# EAGLE design Teensy_board (EAGLE 7.1.0)
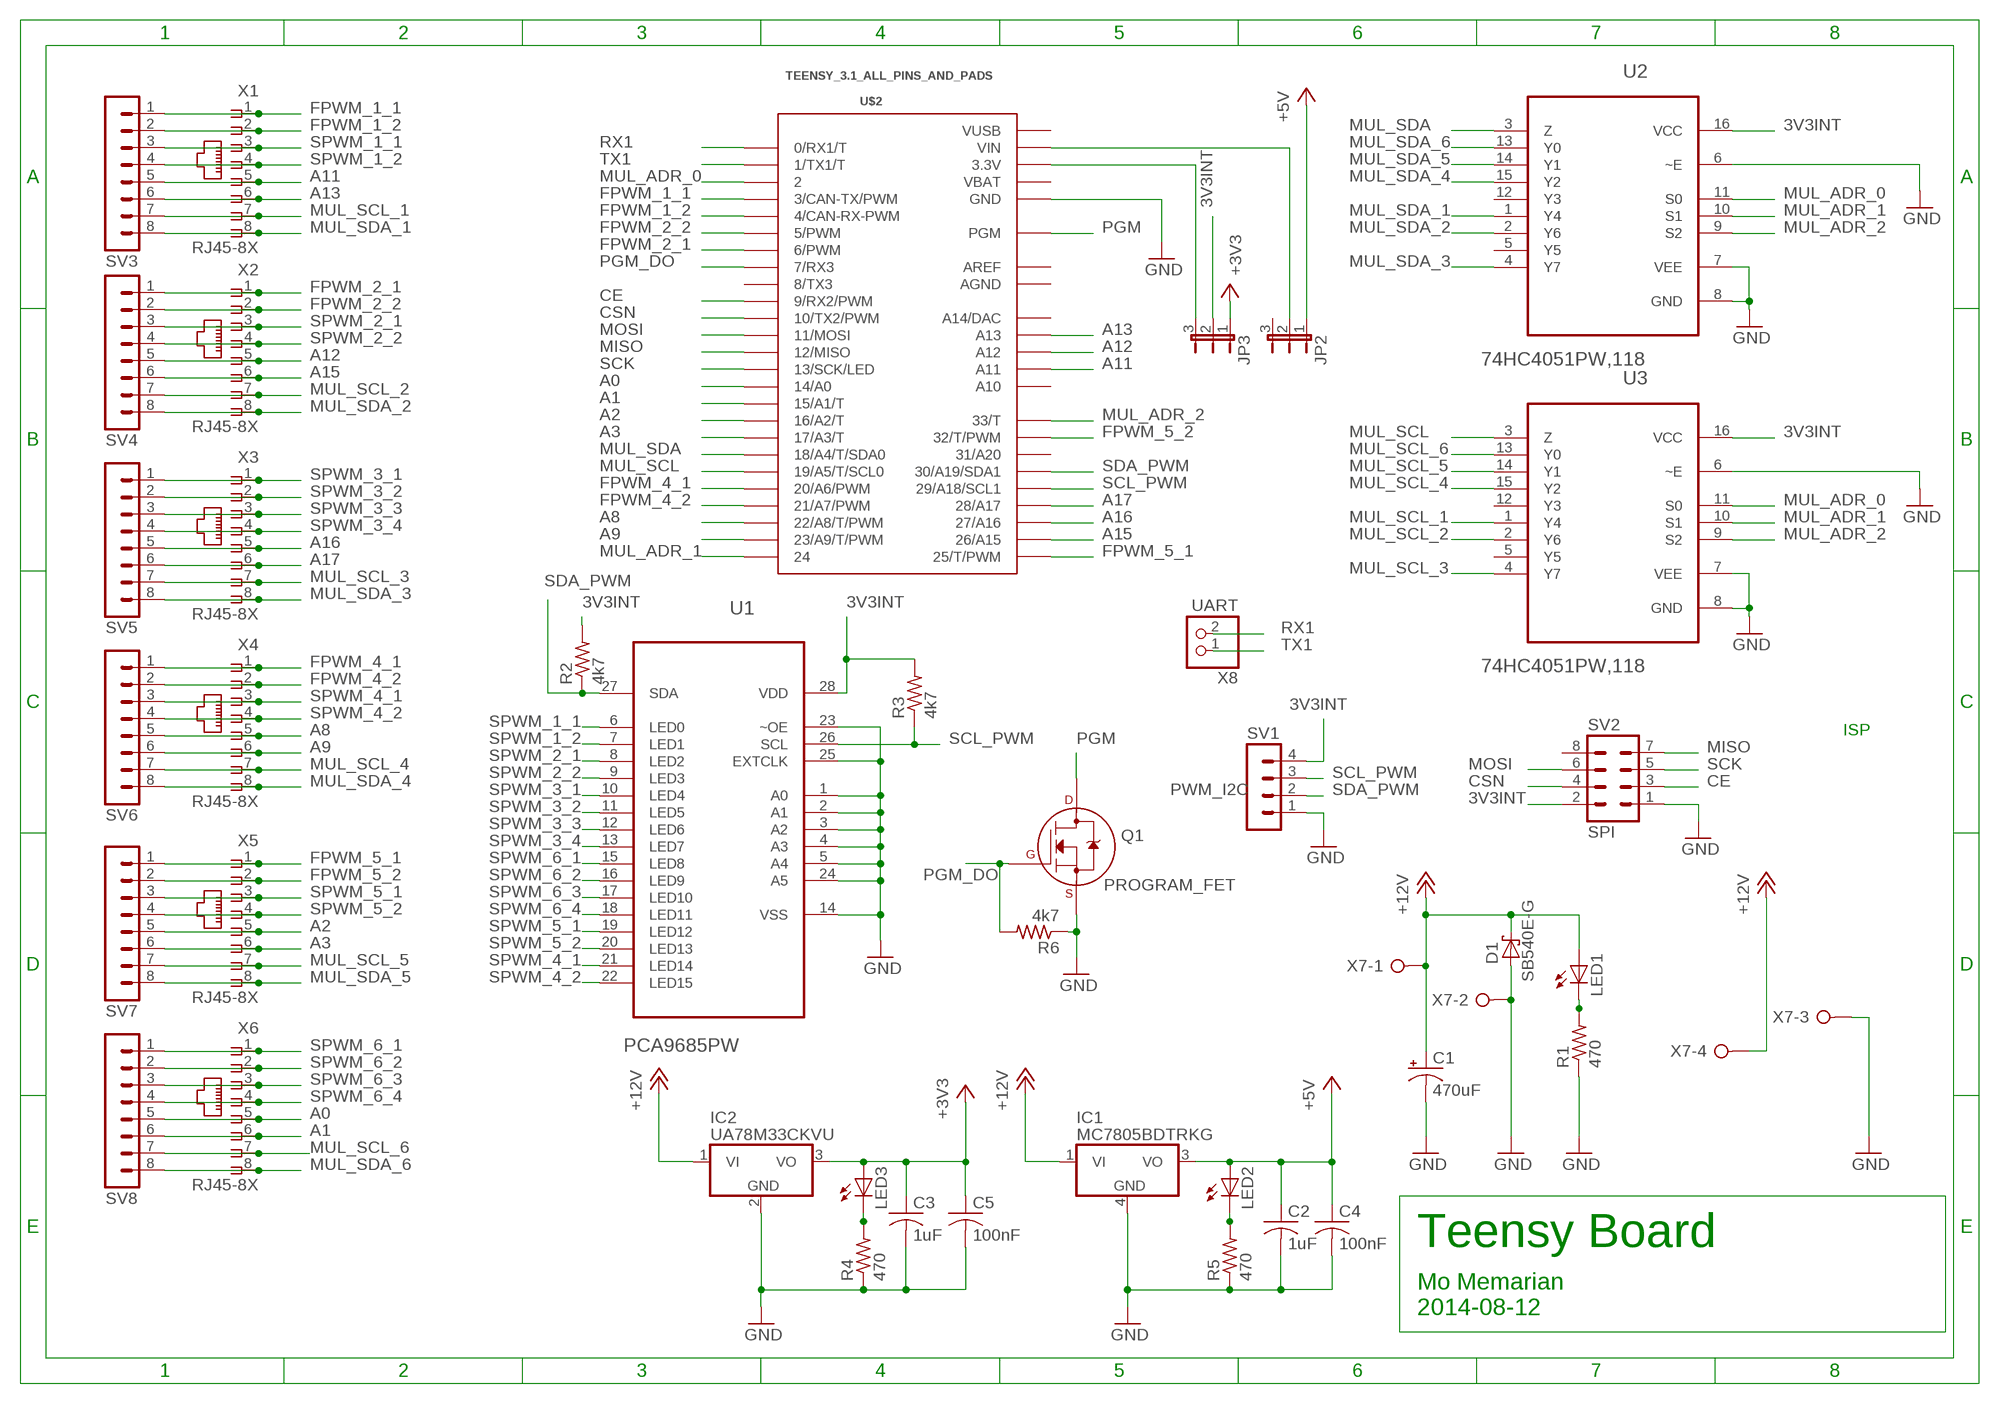
[diagram p0: schematic, sheet 1]

## Parts
C1  470uF  CPOL-USE5-10.5  [E5-10,5]
C2  1uF  C-USC0603  [C0603]
C3  1uF  C-USC0603  [C0603]
C4  100nF  C-USC0603  [C0603]
C5  100nF  C-USC0603  [C0603]
D1  SB540E-G  [DO201T15]
IC1  MC7805BDTRKG  [DPACK_3]
IC2  UA78M33CKVU  [DPACK]
JP2  JP2E  [JP2]
JP3  JP2E  [JP2]
LED1  LEDSML1206  [SML1206]
LED2  LEDSML1206  [SML1206]
LED3  LEDSML1206  [SML1206]
Q1  PROGRAM_FET  2N7002_SOT23  [SOT-23]
R1  470  R-US_R0603  [R0603]
R2  4k7  R-US_R0603  [R0603]
R3  4k7  R-US_R0603  [R0603]
R4  470  R-US_R0603  [R0603]
R5  470  R-US_R0603  [R0603]
R6  4k7  R-US_R0603  [R0603]
SV1  PWM_I2C  MA04-1  [MA04-1]
SV2  SPI  MA04-2  [MA04-2]
SV3  MA08-1  [MA08-1]
SV4  MA08-1  [MA08-1]
SV5  MA08-1  [MA08-1]
SV6  MA08-1  [MA08-1]
SV7  MA08-1  [MA08-1]
SV8  MA08-1  [MA08-1]
U1  PCA9685PW  [SOP65P640X110-28N]
U2  74HC4051PW,118  [SOP65P640X110-16N]
U3  74HC4051PW,118  [SOP65P640X110-16N]
U$2  TEENSY_3.1_ALL_PINS_AND_PADS  [TEENSY_3.1_ALLPINS]
X1  RJ45-8X  [RJ45-NO-SHIELD]
X2  RJ45-8X  [RJ45-NO-SHIELD]
X3  RJ45-8X  [RJ45-NO-SHIELD]
X4  RJ45-8X  [RJ45-NO-SHIELD]
X5  RJ45-8X  [RJ45-NO-SHIELD]
X6  RJ45-8X  [RJ45-NO-SHIELD]
X7  W237-04P  [W237-4P]
X8  UART  PINHD-1X2  [1X02]

## Nets
3V3INT: JP3.2 R2.2 R3.2 SV1.4 SV2.2 U1.28(VDD) U2.16(VCC) U3.16(VCC)
+3V3: C3.1 C5.1 IC2.3(VO) JP3.1 LED3.A
+5V: C2.1 C4.1 IC1.3(VO) JP2.1 LED2.A
+12V: C1.+ D1.C IC1.1(VI) IC2.1(VI) LED1.A X7.1 X7.4
A0: SV8.5 U$2.14/A0 X6.5
A1: SV8.6 U$2.15/A1(15/A1/T) X6.6
A2: SV7.5 U$2.16/A2(16/A2/T) X5.5
A3: SV7.6 U$2.17/A3(17/A3/T) X5.6
A8: SV6.5 U$2.22/A8(22/A8/T/PWM) X4.5
A9: SV6.6 U$2.23/A9(23/A9/T/PWM) X4.6
A11: SV3.5 U$2.A11 X1.5
A12: SV4.5 U$2.A12 X2.5
A13: SV3.6 U$2.A13 X1.6
A15: SV4.6 U$2.26(26/A15) X2.6
A16: SV5.5 U$2.27(27/A16) X3.5
A17: SV5.6 U$2.28(28/A17) X3.6
CE: SV2.3 U$2.9(9/RX2/PWM)
CSN: SV2.4 U$2.10(10/TX2/PWM)
FPWM_1_1: SV3.1 U$2.3(3/CAN-TX/PWM) X1.1
FPWM_1_2: SV3.2 U$2.4(4/CAN-RX-PWM) X1.2
FPWM_2_1: SV4.1 U$2.6(6/PWM) X2.1
FPWM_2_2: SV4.2 U$2.5(5/PWM) X2.2
FPWM_4_1: SV6.1 U$2.20/A6(20/A6/PWM) X4.1
FPWM_4_2: SV6.2 U$2.21/A7(21/A7/PWM) X4.2
FPWM_5_1: SV7.1 U$2.25(25/T/PWM) X5.1
FPWM_5_2: SV7.2 U$2.32(32/T/PWM) X5.2
GND: C1.- C2.2 C3.2 C4.2 C5.2 D1.A IC1.4(GND) IC2.2(GND) Q1.2(S) R1.1 R4.1 R5.1 R6.1 SV1.1 SV2.1 U1.1(A0) U1.2(A1) U1.3(A2) U1.4(A3) U1.5(A4) U1.14(VSS) U1.23(~OE) U1.24(A5) U1.25(EXTCLK) U2.6(~E) U2.7(VEE) U2.8(GND) U3.6(~E) U3.7(VEE) U3.8(GND) U$2.GND U$2.GND1(GND) U$2.GND2(GND) X7.2 X7.3
MISO: SV2.7 U$2.12(12/MISO)
MOSI: SV2.6 U$2.11(11/MOSI)
MUL_ADR_0: U2.11(S0) U3.11(S0) U$2.2
MUL_ADR_1: U2.10(S1) U3.10(S1) U$2.24
MUL_ADR_2: U2.9(S2) U3.9(S2) U$2.33(33/T)
MUL_SCL: U3.3(Z) U$2.19/A5(19/A5/T/SCL0)
MUL_SCL_1: SV3.7 U3.1(Y4) X1.7
MUL_SCL_2: SV4.7 U3.2(Y6) X2.7
MUL_SCL_3: SV5.7 U3.4(Y7) X3.7
MUL_SCL_4: SV6.7 U3.15(Y2) X4.7
MUL_SCL_5: SV7.7 U3.14(Y1) X5.7
MUL_SCL_6: SV8.7 U3.13(Y0) X6.7
MUL_SDA: U2.3(Z) U$2.18/A4(18/A4/T/SDA0)
MUL_SDA_1: SV3.8 U2.1(Y4) X1.8
MUL_SDA_2: SV4.8 U2.2(Y6) X2.8
MUL_SDA_3: SV5.8 U2.4(Y7) X3.8
MUL_SDA_4: SV6.8 U2.15(Y2) X4.8
MUL_SDA_5: SV7.8 U2.14(Y1) X5.8
MUL_SDA_6: SV8.8 U2.13(Y0) X6.8
N$10: LED1.C R1.2
N$18: LED3.C R4.2
N$19: LED2.C R5.2
PGM: Q1.3(D) U$2.PGM
PGM_DO: Q1.1(G) R6.2 U$2.7(7/RX3)
RX1: U$2.0(0/RX1/T) X8.2
SCK: SV2.5 U$2.13(13/SCK/LED)
SCL_PWM: R3.1 SV1.3 U1.26(SCL) U$2.29(29/A18/SCL1)
SDA_PWM: R2.1 SV1.2 U1.27(SDA) U$2.30(30/A19/SDA1)
SPWM_1_1: SV3.3 U1.6(LED0) X1.3
SPWM_1_2: SV3.4 U1.7(LED1) X1.4
SPWM_2_1: SV4.3 U1.8(LED2) X2.3
SPWM_2_2: SV4.4 U1.9(LED3) X2.4
SPWM_3_1: SV5.1 U1.10(LED4) X3.1
SPWM_3_2: SV5.2 U1.11(LED5) X3.2
SPWM_3_3: SV5.3 U1.12(LED6) X3.3
SPWM_3_4: SV5.4 U1.13(LED7) X3.4
SPWM_4_1: SV6.3 U1.21(LED14) X4.3
SPWM_4_2: SV6.4 U1.22(LED15) X4.4
SPWM_5_1: SV7.3 U1.19(LED12) X5.3
SPWM_5_2: SV7.4 U1.20(LED13) X5.4
SPWM_6_1: SV8.1 U1.15(LED8) X6.1
SPWM_6_2: SV8.2 U1.16(LED9) X6.2
SPWM_6_3: SV8.3 U1.17(LED10) X6.3
SPWM_6_4: SV8.4 U1.18(LED11) X6.4
TEENSY_3V3: JP3.3 U$2.3.3V U$2.3.3V1(3.3V) U$2.3.3V2(3.3V)
TEENSY_VIN: JP2.2 U$2.VIN
TX1: U$2.1(1/TX1/T) X8.1
Unconnected: JP2.3 SV2.8 U2.5(Y5) U2.12(Y3) U3.5(Y5) U3.12(Y3) U$2.8(8/TX3) U$2.31(31/A20) U$2.A10 U$2.A14(A14/DAC)

## Notes on the sheet
- ISP
- Teensy Board
- Mo Memarian
  2014-08-12

## Power pins joined to a net without a drawn wire
AGND: U$2.AGND
AREF: U$2.AREF
VBAT: U$2.VBAT
VUSB: U$2.VUSB

## Library data of the parts
C1 = rcl:CPOL-US: POLARIZED CAPACITOR, American symbol
C2-C5 = rcl:C-US: CAPACITOR, American symbol
D1 = CBLA_Test_bed_Library:SB540E-G: SCHOTTKY BARRIER RECTIFIER 3.0 AMPERES 20, 30, 40 VOLT Source: MBRS340T3-D.pdf
IC1 = CBLA_Test_bed_Library:MC78: 1A Positive Voltage Regulators Source: Data sheet <http://www.onsemi.com/pub_link/Collateral/MC7800-D.PDF>
IC2 = CBLA_Test_bed_Library:UA78M: Linear Voltage Reg Datasheet <http://www.ti.com/lit/ds/symlink/ua78m05.pdf>
JP2 JP3 = jumper:JP2E: JUMPER
LED1-LED3 = led:LED: LED OSRAM: - CHIPLED LG R971, LG N971, LY N971, LG Q971, LY Q971, LO R971, LY R971 LH N974, LH R974 LS Q976, LO Q976, LY Q976 LO Q996 - Hyper CHIPLED LW Q18S LB Q993, LB Q99A, LB R99A - SideLED LS A670, LO A670, LY A670, LG A670, LP A670 LB A673, LV A673, LT A673, LW A673 LH A674 LY A675 LS A676, LA A676, LO A676, LY A676, LW A676 LS A679, LY A679, LG A679 - Hyper Micro SIDELED® LS Y876, LA Y876, LO Y876, LY Y876 LT Y87S - SmartLED LW L88C, LW L88S LB L89C, LB L89S, LG L890 LS L89K, LO L89K, LY L89K LS L896, LA L896, LO L896, LY L896 - TOPLED LS T670, LO T670, LY T670, LG T670, LP T670 LSG T670, LSP T670, LSY T670, LOP T670, LYG T670 LG T671, LOG T671, LSG T671 LB T673, LV T673, LT T673, LW T673 LH T674 LS T676, LA T676, LO T676, LY T676, LB T676, LH T676, LSB T676, LW T676 LB T67C, LV T67C, LT T67C, LS T67K, LO T67K, LY T67K, LW E67C LS E67B, LA E67B, LO E67B, LY E67B, LB E67C, LV E67C, LT E67C LW T67C LS T679, LY T679, LG T679 LS T770, LO T770, LY T770, LG T770, LP T770 LB T773, LV T773, LT T773, LW T773 LH T774 LS E675, LA E675, LY E675, LS T675 LS T776, LA T776, LO T776, LY T776, LB T776 LHGB T686 LT T68C, LB T68C - Hyper Mini TOPLED® LB M676 - Mini TOPLED Santana® LG M470 LS M47K, LO M47K, LY M47K Source: http://www.osram.convergy.de LUXEON: - LUMILED® LXK2-PW12-R00, LXK2-PW12-S00, LXK2-PW14-U00, LXK2-PW14-V00 LXK2-PM12-R00, LXK2-PM12-S00, LXK2-PM14-U00 LXK2-PE12-Q00, LXK2-PE12-R00, LXK2-PE12-S00, LXK2-PE14-T00, LXK2-PE14-U00 LXK2-PB12-K00, LXK2-PB12-L00, LXK2-PB12-M00, LXK2-PB14-N00, LXK2-PB14-P00, LXK2-PB14-Q00 LXK2-PR12-L00, LXK2-PR12-M00, LXK2-PR14-Q00, LXK2-PR14-R00 LXK2-PD12-Q00, LXK2-PD12-R00, LXK2-PD12-S00 LXK2-PH12-R00, LXK2-PH12-S00 LXK2-PL12-P00, LXK2-PL12-Q00, LXK2-PL12-R00 Source: www.luxeon.com KINGBRIGHT: KA-3528ASYC Source: www.kingbright.com
Q1 = transistors:2N700*: 2N7000, 2N7002, NDS7002A N-channel enhancement mode MOSFET
R1-R6 = CBLA_Test_bed_Library:R-US_: RESISTOR, American symbol
SV1 = con-lstb:MA04-1: PIN HEADER; OC_FARNELL: unknown; OC_NEWARK: unknown
SV2 = con-lstb:MA04-2: PIN HEADER; OC_FARNELL: unknown; OC_NEWARK: unknown
SV3-SV8 = con-lstb:MA08-1: PIN HEADER; OC_FARNELL: unknown; OC_NEWARK: unknown
U1 = NXP_By_element14_Batch_1:PCA9685PW: 16-channel, 12-bit PWM Fm+ I2C-bus LED controller; MPN: PCA9685PW; OC_FARNELL: 1854074; OC_NEWARK: 19T6398; PACKAGE: TSSOP-28; SUPPLIER: NXP
U2 U3 = NXP_By_element14_Batch_1:74HC4051PW,118: 8-channel analog multiplexer/demultiplexer; MPN: 74HC4051PW,118; OC_FARNELL: 1826843; OC_NEWARK: 78R6260; PACKAGE: TSSOP-16; SUPPLIER: NXP
U$2 = Teensy_3_Series_Board_v1.0:TEENSY_3.1_ALL_PINS_AND_PADS: Footprint for Teensy 3.1 board using all pads and all through-holes. Pads need a 2x7 0.1" SMD header.
X1-X6 = CBLA_Test_bed_Library:RJ45: CORCOM Modular RJ Jacks No Shield Source: www.tycoelectronics.com .. ENG_DS_1654001_1099_RJ_L_0507.pdf; MPN: RJ45-8X; OC_FARNELL: unknown; OC_NEWARK: 16R6101
X7 = con-wago-508:W237-04P: WAGO SREW CLAMP; OC_FARNELL: unknown; OC_NEWARK: unknown
X8 = CBLA_Test_bed_Library:PINHD-1X2: PIN HEADER

## Board
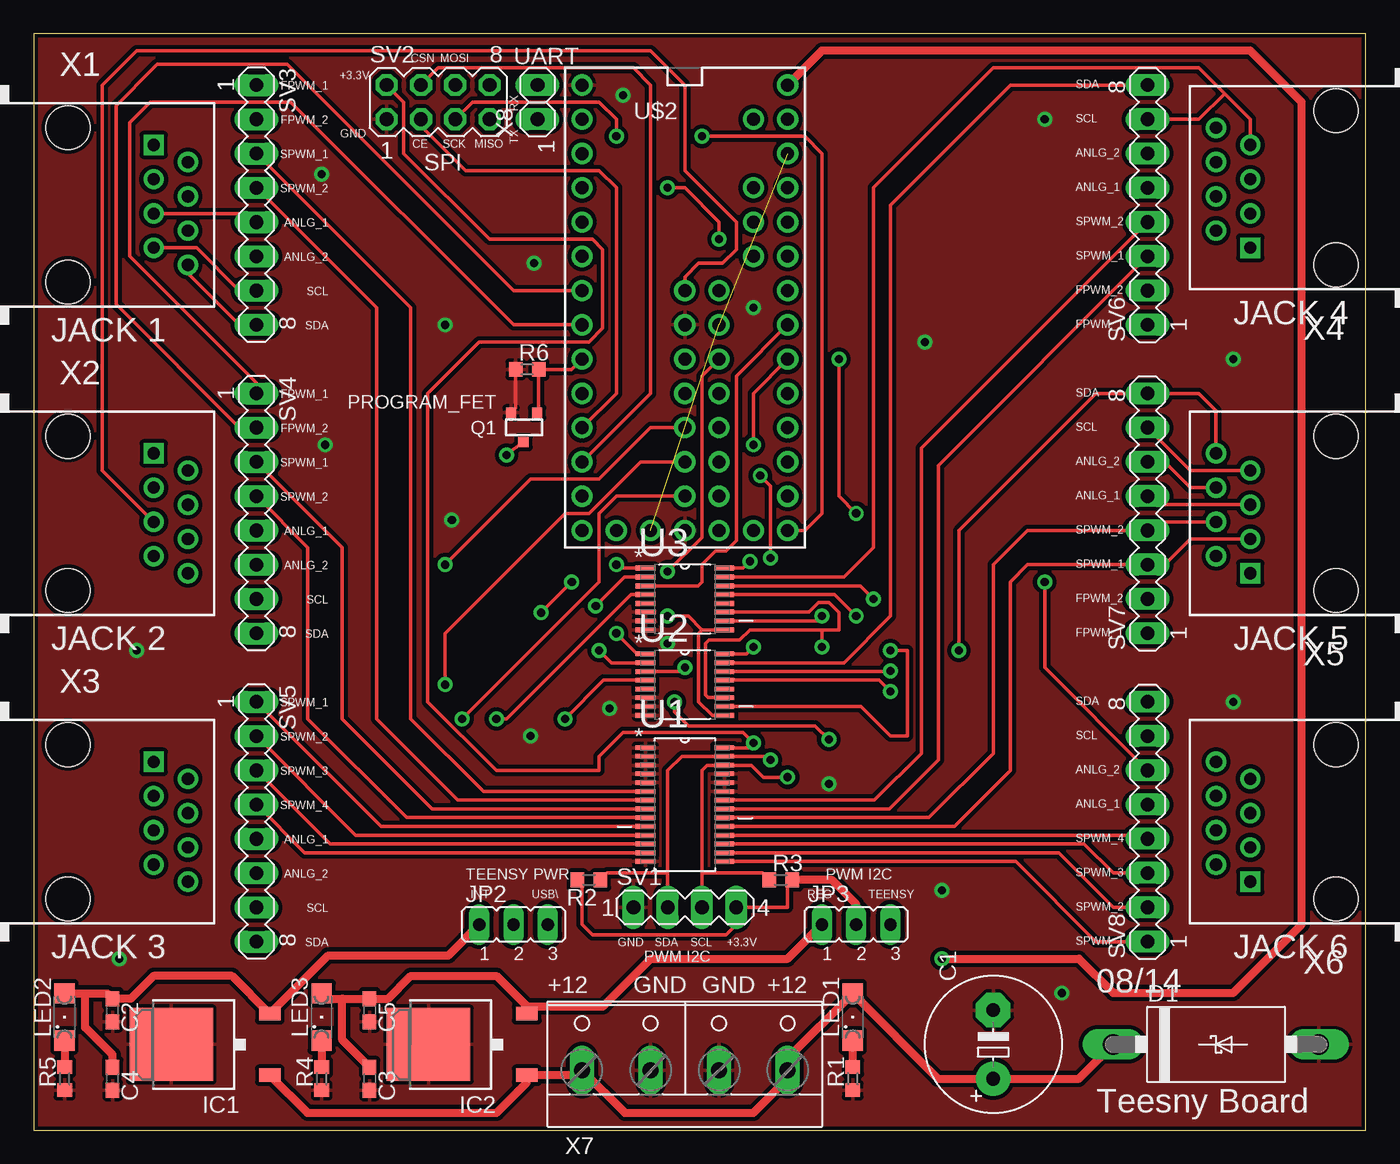
[diagram p1: board, top side]
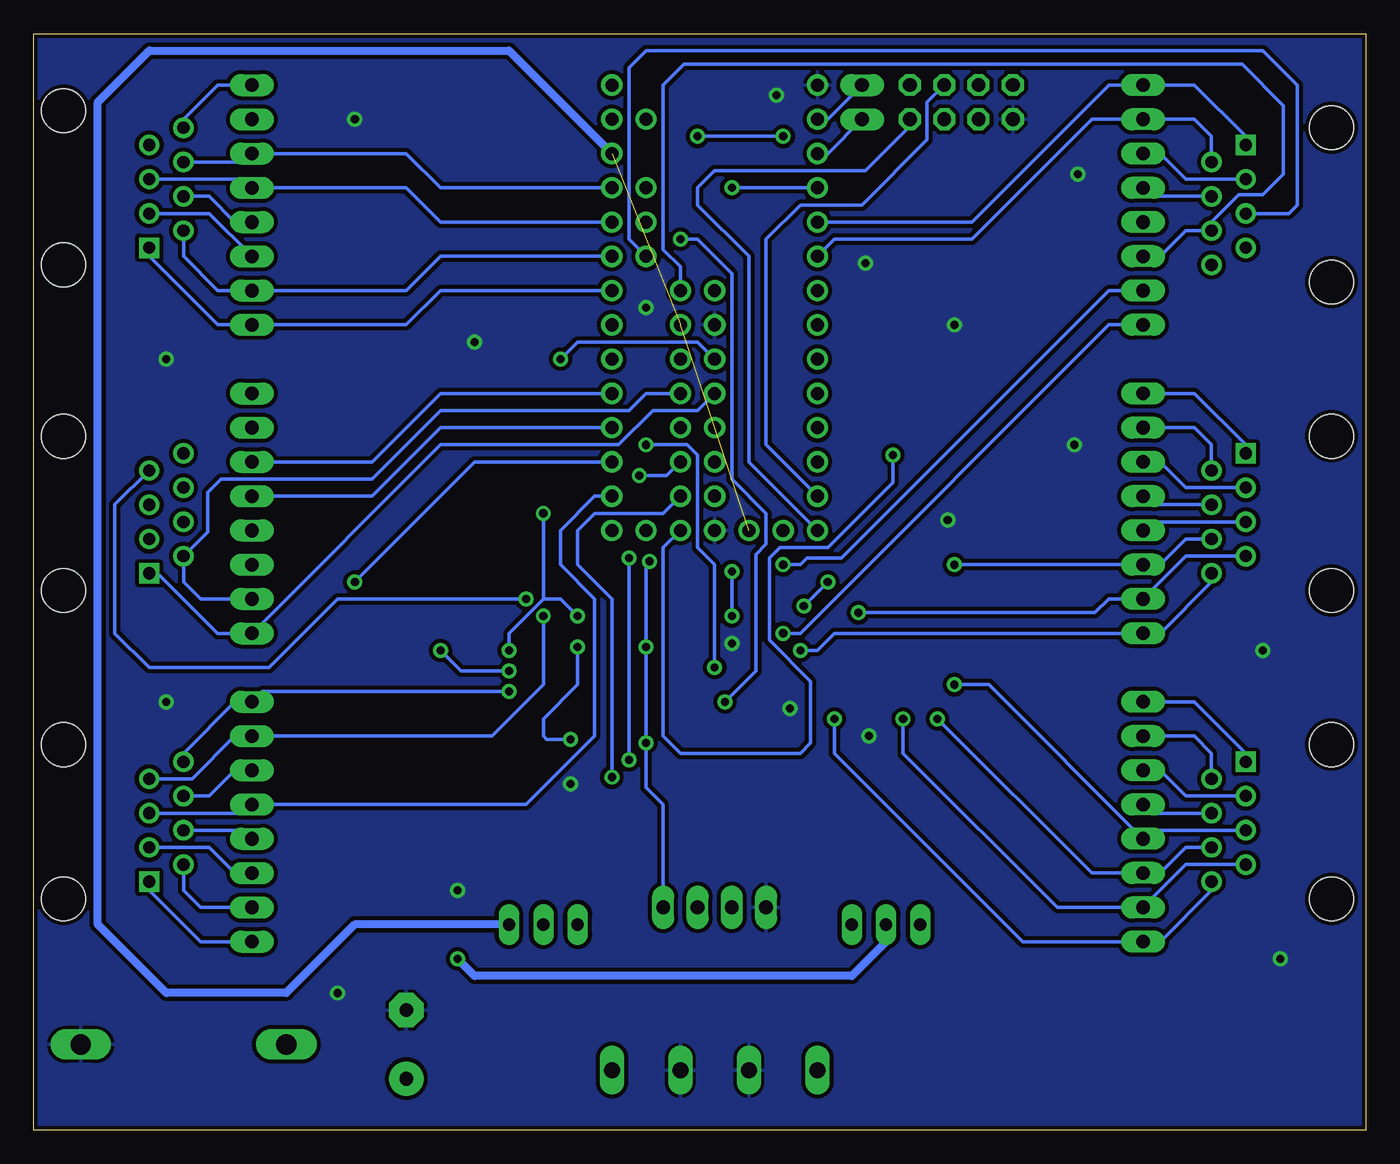
[diagram p2: board, bottom side, seen from below]

Size 98.73 x 81.27 mm. Coordinates in mm from the lower left corner, seen from the top.
Outline: 0,0 98.73,0 98.73,81.27 0,81.27 0,0
Copper layers (1*16): Top 0.035mm / dielectric 1.5mm / Bottom 0.035mm
Design rules "SparkFun": minimum track width 8mil, minimum drill 20mil, track to track 8mil, track to pad 8mil, pad to pad 8mil, via to via 8mil, smd to smd 8mil, copper to edge 10mil, drill to drill 8mil, minimum pad ring 12mil, minimum via ring 10mil, stop-mask expansion 4mil, vias tented up to drill 25mil, thermal gap 10mil

### Footprints (pad centres in the part's own frame; a part is rotated, then mirrored left to right if it is on the bottom)
E5-10,5 = drill 1.016 pad 2.54: + -2.54,0 | drill 1.016 pad 2.54 octagon: - 2.54,0
C0603 = smd 1.1 x 1: 1 -0.85,0; 2 0.85,0
DO201T15 = drill 1.499 long: A 7.62,0; C -7.62,0
DPACK_3 = smd 1 x 1.6: 1 -2.28,-4.8; 3 2.28,-4.8 | smd 5.4 x 6.2: 4 0,2.5
DPACK = smd 1 x 1.6: 1 -2.28,-4.8; 3 2.28,-4.8 | smd 5.4 x 6.2: 2 0,2.5
JP2 = drill 0.914 long: 1 -2.54,0; 2 0,0; 3 2.54,0
SML1206 = smd 1.5 x 1.5: A 1.75,0; C -1.75,0
SOT-23 = smd 0.762 x 0.762: 1 -0.979,-1.101; 2 0.94,-1.101; 3 0.025,1.067
R0603 = smd 1 x 1.1: 1 -0.85,0; 2 0.85,0
MA04-1 = drill 1.016 long: 1 -3.81,0; 2 -1.27,0; 3 1.27,0; 4 3.81,0
MA04-2 = drill 1.016 octagon: 1 -3.81,-1.27; 2 -3.81,1.27; 3 -1.27,-1.27; 4 -1.27,1.27; 5 1.27,-1.27; 6 1.27,1.27; 7 3.81,-1.27; 8 3.81,1.27
MA08-1 = drill 1.016 long: 1 -8.89,0; 2 -6.35,0; 3 -3.81,0; 4 -1.27,0; 5 1.27,0; 6 3.81,0; 7 6.35,0; 8 8.89,0
SOP65P640X110-28N = smd 1.473 x 0.356: 1 -2.921,4.216; 2 -2.921,3.581; 3 -2.921,2.921; 4 -2.921,2.286; 5 -2.921,1.626; 6 -2.921,0.965; 7 -2.921,0.33; 8 -2.921,-0.33; 9 -2.921,-0.965; 10 -2.921,-1.626; 11 -2.921,-2.286; 12 -2.921,-2.921; 13 -2.921,-3.581; 14 -2.921,-4.216; 15 2.921,-4.216; 16 2.921,-3.581; 17 2.921,-2.921; 18 2.921,-2.286; 19 2.921,-1.626; 20 2.921,-0.965; 21 2.921,-0.33; 22 2.921,0.33; 23 2.921,0.965; 24 2.921,1.626; 25 2.921,2.286; 26 2.921,2.921; 27 2.921,3.581; 28 2.921,4.216
SOP65P640X110-16N = smd 1.473 x 0.356: 1 -2.921,2.286; 2 -2.921,1.626; 3 -2.921,0.965; 4 -2.921,0.33; 5 -2.921,-0.33; 6 -2.921,-0.965; 7 -2.921,-1.626; 8 -2.921,-2.286; 9 2.921,-2.286; 10 2.921,-1.626; 11 2.921,-0.965; 12 2.921,-0.33; 13 2.921,0.33; 14 2.921,0.965; 15 2.921,1.626; 16 2.921,2.286
TEENSY_3.1_ALLPINS = drill 0.965: 0 -7.62,15.24; 1 -7.62,12.7; 2 -7.62,10.16; 3 -7.62,7.62; 3.3V 7.62,12.7; 3.3V1 -2.54,-15.24; 3.3V2 2.54,0; 4 -7.62,5.08; 5 -7.62,2.54; 6 -7.62,0; 7 -7.62,-2.54; 8 -7.62,-5.08; 9 -7.62,-7.62; 10 -7.62,-10.16; 11 -7.62,-12.7; 12 -7.62,-15.24; 13 7.62,-15.24; 14/A0 7.62,-12.7; 15/A1 7.62,-10.16; 16/A2 7.62,-7.62; 17/A3 7.62,-5.08; 18/A4 7.62,-2.54; 19/A5 7.62,0; 20/A6 7.62,2.54; 21/A7 7.62,5.08; 22/A8 7.62,7.62; 23/A9 7.62,10.16; 24 0,-2.54; 25 0,-5.08; 26 0,-7.62; 27 0,-10.16; 28 0,-12.7; 29 2.54,-12.7; 30 2.54,-10.16; 31 2.54,-7.62; 32 2.54,-5.08; 33 2.54,-2.54; A10 5.08,7.62; A11 5.08,5.08; A12 0,2.54; A13 2.54,2.54; A14 5.08,-15.24; AGND 7.62,15.24; AREF 5.08,10.16; GND -7.62,17.78; GND1 0,-15.24; GND2 0,0; PGM 2.54,-15.24; VBAT -5.08,-15.24; VIN 7.62,17.78; VUSB 5.08,15.24
RJ45-NO-SHIELD = drill 0.9 pad 1.4 square: 1 -4.445,6.35 | drill 0.9 pad 1.4: 2 -3.175,8.89; 3 -1.905,6.35; 4 -0.635,8.89; 5 0.635,6.35; 6 1.905,8.89; 7 3.175,6.35; 8 4.445,8.89 | hole 3.251: -5.715,0; 5.715,0
W237-4P = drill 1.194 long: 1 -7.62,-0.635; 2 -2.54,-0.635; 3 2.54,-0.635; 4 7.62,-0.635
1X02 = drill 1.016 long: 1 -1.27,0; 2 1.27,0

### Placement (x,y rotation side)
C1  71.12,6.35 90 top
C2  5.84,8.89 270 top
C3  24.89,3.81 270 top
C4  5.84,3.81 270 top
C5  24.89,8.89 270 top
D1  87.63,6.35 0 top
IC1  12.7,6.35 90 top
IC2  31.75,6.35 90 top
JP2  35.56,15.24 0 top
JP3  60.96,15.24 0 top
LED1  60.71,8.38 90 top
LED2  2.29,8.38 90 top
LED3  21.34,8.38 90 top
Q1  36.32,52.07 180 top
R1  60.71,3.81 90 top
R2  41.15,18.54 180 top
R3  55.37,18.54 0 top
R4  21.34,3.81 90 top
R5  2.29,3.81 90 top
R6  36.58,56.39 0 top
SV1  48.26,16.51 0 top
SV2  29.97,76.2 0 top
SV3  16.51,68.58 270 top
SV4  16.51,45.72 270 top
SV5  16.51,22.86 270 top
SV6  82.55,68.58 90 top
SV7  82.55,45.72 90 top
SV8  82.55,22.86 90 top
U1  48.26,24.13 0 top
U2  48.26,33.02 0 top
U3  48.26,39.37 0 top
U$2  48.26,59.69 0 top
X1  2.54,68.58 270 top
X2  2.54,45.72 270 top
X3  2.54,22.86 270 top
X4  96.52,69.85 90 top
X5  96.52,45.72 90 top
X6  96.52,22.86 90 top
X7  48.26,5.08 0 top
X8  37.34,76.2 90 top

### Tracks (layer width: path | path; a pad name or v marks a point on that pad's centre or on a via)
3V3INT  (via drill 0.6)
  Top 0.254: U2.16 52.83,35.31 v53.34,35.81 | U3.16 52.58,41.66 v53.09,42.16 | R3.2 55.88,18.2 55.88,16.51 SV1.4 52.07,15.24 51.31,14.48 41.4,14.48 40.64,15.24 40.64,18.2 R2.2 | SV2.2 27.43,76.2 27.43,72.39 33.78,66.04 41.4,66.04 42.16,65.28 42.16,59.44 41.15,58.42 33.02,58.42 29.21,54.61 29.21,31.75 34.29,26.67 41.91,26.67 41.91,27.69 43.69,29.46 52.58,29.46 v53.34,28.7 52.98,28.35 U1.28
  Top 0.61: JP3.2 60.96,16.76 59.18,18.54 R3.2
  Bottom 0.254: v53.09,42.16 53.34,41.91 v53.34,35.81 v53.34,28.7 53.34,25.4 52.07,24.13 SV1.4
+3V3
  Top 0.61: LED3.A 21.73,9.74 22.86,9.74 | 22.86,9.74 C5.1 26.25,9.74 27.94,11.43 34.29,11.43 36.55,9.17 | C3.1 22.86,6.69 22.86,9.74 | IC2.3 36.55,9.17 | 36.55,9.17 42.19,9.17 45.72,12.7 55.88,12.7 JP3.1
+5V
  Top 0.61: LED2.A 3.81,10.13 | 3.81,10.13 5.45,10.13 C2.1 7.2,9.74 8.89,11.43 14.7,11.43 IC1.3 21.82,12.95 30.73,12.95 JP2.1 | C4.1 5.84,5.59 3.81,7.62 3.81,10.13
+12V
  Top 0.61: D1.C 77.47,3.81 C1.+ 67.03,3.81 LED1.A 55.88,5.31 X7.4 55.88,3.81 53.34,1.27 43.81,1.27 X7.1 40.27,4.07 IC2.1 36.55,3.53 34.29,1.27 20.3,1.27 IC1.1
A0
  Bottom 0.254: U$2.14/A0 57.15,46.99 59.69,44.45 59.69,41.91 57.15,39.37 57.15,29.21 62.23,24.13 SV8.5 83.19,23.5 X6.5
A1  (via drill 0.6)
  Top 0.254: v74.93,40.64 74.93,34.29 SV8.6
  Bottom 0.254: U$2.15/A1 66.04,49.53 v74.93,40.64 | X6.6 85.72,24.77 83.82,26.67 SV8.6
A2
  Top 0.254: X5.5 83.19,46.35 SV7.5
  Bottom 0.254: U$2.16/A2 68.58,52.07 73.66,46.99 SV7.5
A3
  Top 0.254: X5.6 85.72,47.62 83.82,49.53 SV7.6
  Bottom 0.254: U$2.17/A3 68.58,54.61 73.66,49.53 SV7.6
A8
  Bottom 0.254: U$2.22/A8 68.58,67.31 71.12,69.85 SV6.5 83.19,70.48 X4.5
A9
  Bottom 0.254: U$2.23/A9 68.58,69.85 71.12,72.39 SV6.6 83.19,71.75 X4.6
A11
  Top 0.254: X1.5 15.88,67.94 SV3.5
  Bottom 0.254: U$2.A11 54.61,66.04 54.61,78.74 53.34,80.01 7.62,80.01 5.08,77.47 5.08,68.58 5.71,67.94 X1.5
A12
  Top 0.254: U$2.A12 48.26,63.25 49.28,64.26 51.05,64.26 52.07,65.28 52.07,67.31 48.26,71.12 48.26,77.47 45.72,80.01 7.62,80.01 5.08,77.47 5.08,48.9 X2.5
  Bottom 0.254: X2.5 15.88,45.09 SV4.5
A13
  Bottom 0.254: U$2.A13 50.8,64.01 52.07,65.28 52.07,77.47 50.55,78.99 9.14,78.99 6.1,75.95 6.1,70.87 7.62,69.34 9.4,69.34 11.43,67.31 X1.6 13.34,66.67 15.24,64.77 SV3.6
A15  (via drill 0.6)
  Top 0.254: U$2.26 45.72,52.07 41.91,48.26 36.83,48.26 v30.48,41.91
  Bottom 0.254: v30.48,41.91 SV4.6 15.24,41.91 13.34,43.81 X2.6
A16  (via drill 0.6)
  Top 0.254: v30.48,33.02 30.48,36.83 39.37,45.72 41.15,45.72 44.96,49.53 U$2.27
  Bottom 0.254: v30.48,33.02 27.94,33.02 SV5.5 15.88,22.23 X3.5
A17  (via drill 0.6)
  Top 0.254: v31.75,30.48 41.91,40.64 41.91,45.72 43.18,46.99 U$2.28
  Bottom 0.254: v31.75,30.48 20.32,19.05 SV5.6 15.24,19.05 13.34,20.95 X3.6
CE
  Top 0.254: U$2.9 43.18,54.61 43.18,69.85 41.91,71.12 32,71.12 28.7,74.42 SV2.3
CSN
  Top 0.254: U$2.10 45.72,54.61 45.72,77.47 44.45,78.74 29.97,78.74 SV2.4
FPWM_1_1
  Bottom 0.254: U$2.3 29.21,67.31 19.05,77.47 SV3.1 12.7,77.47 8.89,73.66 X1.1
FPWM_1_2
  Bottom 0.254: X1.2 11.43,73.66 12.7,74.93 SV3.2 20.32,74.93 29.21,66.04 39.37,66.04 U$2.4
FPWM_2_1
  Top 0.254: SV4.1 16.51,55.37 7.11,64.77 7.11,74.68 8.64,76.2 19.05,76.2 35.56,59.69 U$2.6
  Bottom 0.254: X2.1 8.89,50.8 12.7,54.61 SV4.1
FPWM_2_2
  Top 0.254: U$2.5 35.56,62.23 18.8,78.99 9.14,78.99 8.89,78.74 6.1,75.95 6.1,61.21 15.24,52.07 SV4.2
  Bottom 0.254: X2.2 11.43,50.8 12.7,52.07 SV4.2
FPWM_4_1
  Bottom 0.254: U$2.20/A6 68.58,62.23 71.12,59.69 SV6.1 85.09,59.69 90.17,64.77 X4.1
FPWM_4_2
  Bottom 0.254: U$2.21/A7 68.58,64.77 71.12,62.23 SV6.2 85.09,62.23 87.63,64.77 X4.2
FPWM_5_1
  Bottom 0.254: U$2.25 49.53,53.34 52.83,53.34 55.37,50.8 68.58,50.8 SV7.1 85.09,36.83 89.53,41.27 X5.1
FPWM_5_2
  Bottom 0.254: U$2.32 53.34,54.61 54.61,53.34 68.58,53.34 73.66,48.26 84.84,48.26 85.85,47.24 85.85,44.32 X5.2 87.63,40.64 86.36,39.37 SV7.2
GND  (via drill 0.6)
  Top 0.254: R6.1 35.73,53.52 Q1.2
  other vias: 42.67,31.24 30.99,45.21 43.69,76.71 53.34,60.96 21.34,70.87 30.48,59.69 58.93,25.65 36.83,29.21 66.04,58.42 88.9,57.15 88.9,31.75 67.31,17.78 76.2,10.16 6.35,12.7 74.93,74.93 7.62,35.56 21.59,50.8 46.99,36.07 37.08,64.26
  pour Top (isolate 0.305, hatched): 0,0 98.81,0 98.81,81.28 0,81.28
  pour Bottom (isolate 0.305, hatched): 0,0 0,81.28 98.81,81.28 98.81,0
MISO
  Bottom 0.254: U$2.12 45.72,49.53 45.72,64.77 49.53,68.58 49.53,69.85 48.26,71.12 37.08,71.12 33.78,74.42 SV2.7
MOSI
  Bottom 0.254: U$2.11 44.45,50.8 44.45,66.04 41.91,68.58 37.34,68.58 32.51,73.41 32.51,76.2 SV2.6
MUL_ADR_0  (via drill 0.6)
  Top 0.254: U3.11 57.45,38.41 58.17,39.12 58.93,39.12 59.69,38.35 59.69,37.08 58.42,37.08 | 58.42,37.08 53.09,37.08 52.32,36.32 50.04,36.32 49.78,36.07 49.78,32.26 49.99,32.05 U2.11 | v46.99,69.85 48.26,69.85 50.8,67.31 v50.8,66.04 | v58.42,35.81 58.42,37.08 | v47.5,31.75 47.5,30.99 48.51,29.97 57.91,29.97 v58.93,28.96
  Bottom 0.254: U$2.2 v46.99,69.85 | v50.8,66.04 49.53,66.04 46.99,63.5 46.99,48.26 44.45,45.72 44.45,43.43 45.21,42.67 45.21,34.04 v47.5,31.75 | v58.93,28.96 60.71,28.96 60.96,29.21 60.96,30.48 58.42,33.02 v58.42,35.81
MUL_ADR_1  (via drill 0.6)
  Top 0.254: U2.10 61.32,31.39 63.5,29.21 64.77,29.21 64.77,35.56 v63.5,35.56 | U3.10 58.06,37.74 v58.42,38.1 | v59.69,57.15 59.69,46.99 v60.96,45.72
  Bottom 0.254: v63.5,35.56 63.5,36.83 60.96,39.37 | 60.96,39.37 59.69,39.37 v58.42,38.1 | U$2.24 49.53,58.42 58.42,58.42 v59.69,57.15 | v60.96,45.72 60.96,39.37
MUL_ADR_2  (via drill 0.6)
  Top 0.254: U2.9 50.29,30.73 49.28,31.75 49.28,36.83 49.53,37.08 | 49.53,37.08 U3.9 | U$2.33 49.53,55.88 49.53,43.94 v46.99,41.4 | v46.99,38.1 48.51,38.1 49.53,37.08
  Bottom 0.254: v46.99,41.4 v46.99,38.1
MUL_SCL
  Top 0.254: U3.3 49.23,40.34 49.53,40.64 49.53,41.91 50.55,42.93 51.31,42.93 52.07,43.69 52.07,55.88 U$2.19/A5
MUL_SCL_1  (via drill 0.6)
  Top 0.254: X1.7 12.06,65.41 15.24,62.23 SV3.7 | U3.1 43.43,41.66 v43.18,41.91
  Bottom 0.254: SV3.7 19.05,62.23 38.86,42.42 41.4,42.42 41.91,41.91 v43.18,41.91
MUL_SCL_2  (via drill 0.6)
  Top 0.254: v39.88,40.64 v37.59,38.35 | U3.2 43.79,41 v41.66,38.86
  Bottom 0.254: v41.66,38.86 v39.88,40.64 | v37.59,38.35 20.07,38.35 19.05,39.37 SV4.7 13.34,42.55 X2.7
MUL_SCL_3  (via drill 0.6)
  Top 0.254: U3.4 44.27,39.7 35.05,30.48 v34.29,30.48
  Bottom 0.254: v34.29,30.48 34.29,27.94 22.86,16.51 SV5.7 13.34,19.68 X3.7
MUL_SCL_4
  Top 0.254: U3.15 60.05,41 62.23,43.18 62.23,69.85 71.12,78.74 86.36,78.74 88.27,76.83 | 88.27,76.83 90.17,74.93 X4.7 | SV6.7 86.36,74.93 88.27,76.83
MUL_SCL_5  (via drill 0.6)
  Top 0.254: U3.14 61.27,40.34 v62.23,39.37 | X5.7 85.72,48.9 SV7.7
  Bottom 0.254: X5.7 92.71,46.35 92.71,36.83 90.17,34.29 81.28,34.29 76.2,39.37 v62.23,39.37
MUL_SCL_6  (via drill 0.6)
  Top 0.254: U3.13 59.36,39.7 v60.96,38.1
  Bottom 0.254: v60.96,38.1 60.96,33.02 64.77,29.21 SV8.7 83.82,29.21 87,26.04 X6.7
MUL_SDA  (via drill 0.6)
  Top 0.254: U2.3 47.95,33.98 v48.26,34.29 | v53.34,50.8 53.34,54.61 U$2.18/A4
  Bottom 0.254: v48.26,34.29 48.26,41.91 49.53,43.18 49.53,50.04 50.29,50.8 v53.34,50.8
MUL_SDA_1  (via drill 0.6)
  Top 0.254: U2.1 44.7,35.31 v43.18,36.83 | X1.8 11.43,63.5 15.24,59.69 SV3.8
  Bottom 0.254: v43.18,36.83 41.91,36.83 19.05,59.69 SV3.8
MUL_SDA_2  (via drill 0.6)
  Top 0.254: U2.2 42.82,34.65 v41.91,35.56
  Bottom 0.254: v41.91,35.56 40.64,35.56 39.37,36.83 SV4.8 15.24,36.83 11.43,40.64 X2.8
MUL_SDA_3  (via drill 0.6)
  Top 0.254: U2.4 42.24,33.35 v39.37,30.48
  Bottom 0.254: v39.37,30.48 39.37,27.94 25.4,13.97 SV5.8 15.24,13.97 11.43,17.78 X3.8
MUL_SDA_4
  Top 0.254: U2.15 60.05,34.65 63.5,38.1 63.5,68.58 72.39,77.47 SV6.8
  Bottom 0.254: X4.8 87.63,74.93 85.09,77.47 SV6.8
MUL_SDA_5  (via drill 0.6)
  Top 0.254: 81.28,54.61 SV7.8 | U2.14 63.45,33.98 v63.5,34.04 | v68.58,35.56 68.58,44.45 78.74,54.61 SV7.8 | X5.8 87.63,53.34 86.36,54.61 SV7.8
  Bottom 0.254: v63.5,34.04 67.06,34.04 v68.58,35.56
MUL_SDA_6  (via drill 0.6)
  Top 0.254: U2.13 62.66,33.35 v63.5,32.51
  Bottom 0.254: X6.8 87.63,27.94 83.82,31.75 SV8.8 81.79,32.51 v63.5,32.51
N$10
  Top 0.61: R1.2 LED1.C
N$18
  Top 0.61: LED3.C R4.2
N$19
  Top 0.61: LED2.C R5.2
PGM  (via drill 0.6)
  Top 0.254: Q1.3 35.03,50.06 v35.05,50.04
  Bottom 0.254: v35.05,50.04 35.05,48.01 39.88,43.18 43.43,43.18 44.2,42.42 44.2,36.32 41.15,33.27 41.15,28.7 41.91,27.94 50.8,27.94 52.07,29.21 52.07,43.18 U$2.PGM
PGM_DO
  Top 0.254: Q1.1 37.43,53.3 R6.2 39.88,56.39 U$2.7
RX1
  Bottom 0.254: U$2.0 39.88,74.93 X8.2
SCK  (via drill 0.6)
  Top 0.254: U$2.13 57.15,44.45 58.42,45.72 58.42,72.39 57.15,73.66 v49.53,73.66 | v43.18,73.66 43.18,74.93 41.91,76.2 32.51,76.2 SV2.5
  Bottom 0.254: v49.53,73.66 v43.18,73.66
SCL_PWM  (via drill 0.6)
  Top 0.254: 49.53,19.05 49.53,26.67 49.91,27.05 U1.26 53.21,27.05 54.1,26.16 v55.88,26.16 | 49.53,19.05 SV1.3 | R3.1 54.01,19.05 49.53,19.05
  Bottom 0.254: v55.88,26.16 55.88,39.37 58.42,41.91 58.42,44.45 57.15,45.72 52.07,45.72 U$2.29
SDA_PWM  (via drill 0.6)
  Top 0.254: v54.61,42.42 54.61,47.75 v53.85,48.51 | 46.99,19.05 46.99,26.67 48.03,27.71 U1.27 54.33,27.71 v54.61,27.43 | 46.99,19.05 SV1.2 | R2.1 42.51,19.05 46.99,19.05
  Bottom 0.254: v54.61,27.43 v54.61,42.42 | v53.85,48.51 51.82,48.51 U$2.30
SPWM_1_1
  Top 0.254: U1.6 33.33,25.09 27.94,30.48 27.94,60.96 SV3.3
  Bottom 0.254: X1.3 13.34,70.48 15.24,72.39 SV3.3
SPWM_1_2
  Top 0.254: U1.7 31.42,24.46 25.4,30.48 25.4,60.96 SV3.4
  Bottom 0.254: X1.4 15.88,69.22 SV3.4
SPWM_2_1
  Top 0.254: U1.8 29.54,23.8 22.86,30.48 22.86,43.18 SV4.3
  Bottom 0.254: X2.3 13.34,47.62 15.24,49.53 SV4.3
SPWM_2_2
  Top 0.254: U1.9 27.64,23.16 20.32,30.48 20.32,43.18 SV4.4
  Bottom 0.254: X2.4 15.88,46.35 SV4.4
SPWM_3_1
  Top 0.254: U1.10 25.76,22.5 SV5.1
  Bottom 0.254: X3.1 8.89,27.94 12.7,31.75 SV5.1
SPWM_3_2
  Top 0.254: U1.11 23.88,21.84 SV5.2
  Bottom 0.254: X3.2 11.43,27.94 12.7,29.21 SV5.2
SPWM_3_3
  Top 0.254: U1.12 21.97,21.21 SV5.3
  Bottom 0.254: X3.3 13.34,24.77 15.24,26.67 SV5.3
SPWM_3_4
  Top 0.254: U1.13 20.09,20.55 SV5.4
  Bottom 0.254: X3.4 15.88,23.5 SV5.4
SPWM_4_1
  Top 0.254: U1.21 63.42,23.8 67.06,27.43 67.06,49.28 SV6.3
  Bottom 0.254: X4.3 85.72,67.94 SV6.3
SPWM_4_2
  Top 0.254: U1.22 62.31,24.46 65.79,27.94 65.79,50.55 SV6.4
  Bottom 0.254: X4.4 85.72,69.22 83.82,67.31 SV6.4
SPWM_5_1
  Top 0.254: U1.19 68.22,22.5 72.39,26.67 72.39,40.64 73.66,41.91 SV7.3 83.82,41.91 85.72,43.81 X5.3
SPWM_5_2
  Top 0.254: U1.20 66.34,23.16 71.12,27.94 71.12,41.91 73.66,44.45 SV7.4 83.19,45.09 X5.4
SPWM_6_1
  Top 0.254: U1.15 72.8,19.91 78.74,13.97 SV8.1
  Bottom 0.254: X6.1 90.17,17.78 86.36,13.97 SV8.1
SPWM_6_2
  Top 0.254: U1.16 75.97,20.55 80.01,16.51 SV8.2
  Bottom 0.254: X6.2 87.63,17.78 86.36,16.51 SV8.2
SPWM_6_3
  Top 0.254: U1.17 77.85,21.21 80.01,19.05 SV8.3
  Bottom 0.254: X6.3 85.72,20.95 83.82,19.05 SV8.3
SPWM_6_4
  Top 0.254: U1.18 82.3,21.84 SV8.4
  Bottom 0.254: X6.4 83.19,22.23 SV8.4
TEENSY_3V3  (2 unrouted)
  Bottom 0.61: JP3.3 74.93,15.24 80.01,10.16 88.9,10.16 93.98,15.24 93.98,76.2 90.17,80.01 63.5,80.01 U$2.3.3V
TEENSY_VIN  (via drill 0.6)
  Top 0.61: v67.31,12.7 77.47,12.7 80.01,10.16 88.9,10.16 93.98,15.24 93.98,76.2 90.17,80.01 58.42,80.01 U$2.VIN
  Bottom 0.61: JP2.2 35.56,13.97 38.1,11.43 66.04,11.43 v67.31,12.7
TX1
  Bottom 0.254: U$2.1 39.88,72.39 X8.1

### Text on the board
tPlace: CSN | MOSI | UART | FPWM_1 | +3.3V | RX | SDA | FPWM_2 | SCL | GND | TX | SPWM_1 | CE | SCK | MISO | SPI | ANLG_2 | SPWM_2 | ANLG_1 | ANLG_1 | SPWM_2 | ANLG_2 | SPWM_1 | SCL | FPWM_2 | SDA | JACK 4 | FPWM_1 | JACK 1 | FPWM_1 | SDA | FPWM_2 | SCL | SPWM_1 | ANLG_2 | SPWM_2 | ANLG_1 | ANLG_1 | SPWM_2 | ANLG_2 | SPWM_1 | SCL | FPWM_2 | SDA | FPWM_1 | JACK 2 | JACK 5 | SPWM_1 | SDA | SPWM_2 | SCL | SPWM_3 | ANLG_2 | SPWM_4 | ANLG_1 | ANLG_1 | SPWM_4 | ANLG_2 | TEENSY PWR | PWM I2C | SPWM_3 | INT | USB\ | REG | TEENSY | SCL | SPWM_2 | SDA | GND | SDA | SCL | +3.3V | SPWM_1 | JACK 3 | JACK 6 | PWM I2C | +12 | GND | GND | +12 | 08/14 | Teesny Board